# Altium project DanceFloor.PrjPcb
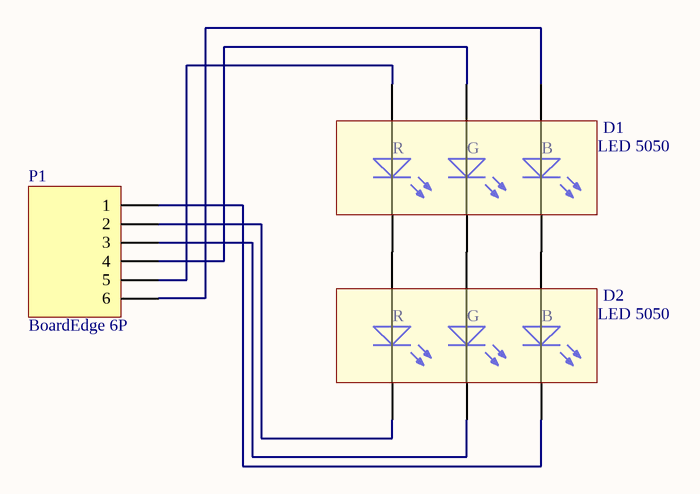
[diagram p0: LED_Adapter.SchDoc]
1 sheet, 3 parts. Net scope: global (net labels, ports and power ports of the same name join across sheets).
Board file: LED_Adapter.PcbDoc

## Sheet LED_Adapter.SchDoc
size A4; Organization: LAN Verein Berg; Address1: co Jürg Horisbeger; Address2: Andhauserstr.13; Address3: 8572 Berg SWITZERLAND; Address4: jhorisberger@gmx.ch

### Parts
D1  LED 5050  [PLCC6]
D2  LED 5050  [PLCC6]
P1  BoardEdge 6P  [BoardEdge Layout 12P Single Side M]

### Nets
NetD1_1: D1.1(K_R) D2.2(A_R)
NetD1_2: D1.2(A_R) P1.5
NetD1_3: D1.3(K_G) D2.4(A_G)
NetD1_4: D1.4(A_G) P1.4
NetD1_5: D1.5(K_B) D2.6(A_B)
NetD1_6: D1.6(A_B) P1.6
NetD2_1: D2.1(K_R) P1.2
NetD2_3: D2.3(K_G) P1.3
NetD2_5: D2.5(K_B) P1.1

### Notes on the sheet
- Title
- Size:
- Date:
- A4
- Number:
- Time:
- Revision:
- Sheet
- of
- File:
- (in symbol LED RGB 5050) R; G; B

### Library data of the parts
D1 D2 = LED RGB 5050: SMD PLCC-6 20mA 5050
P1 = BoardEdge Layout  SS 6P: Layout BoardEdge 6P Single Side TE 7-5530843-6